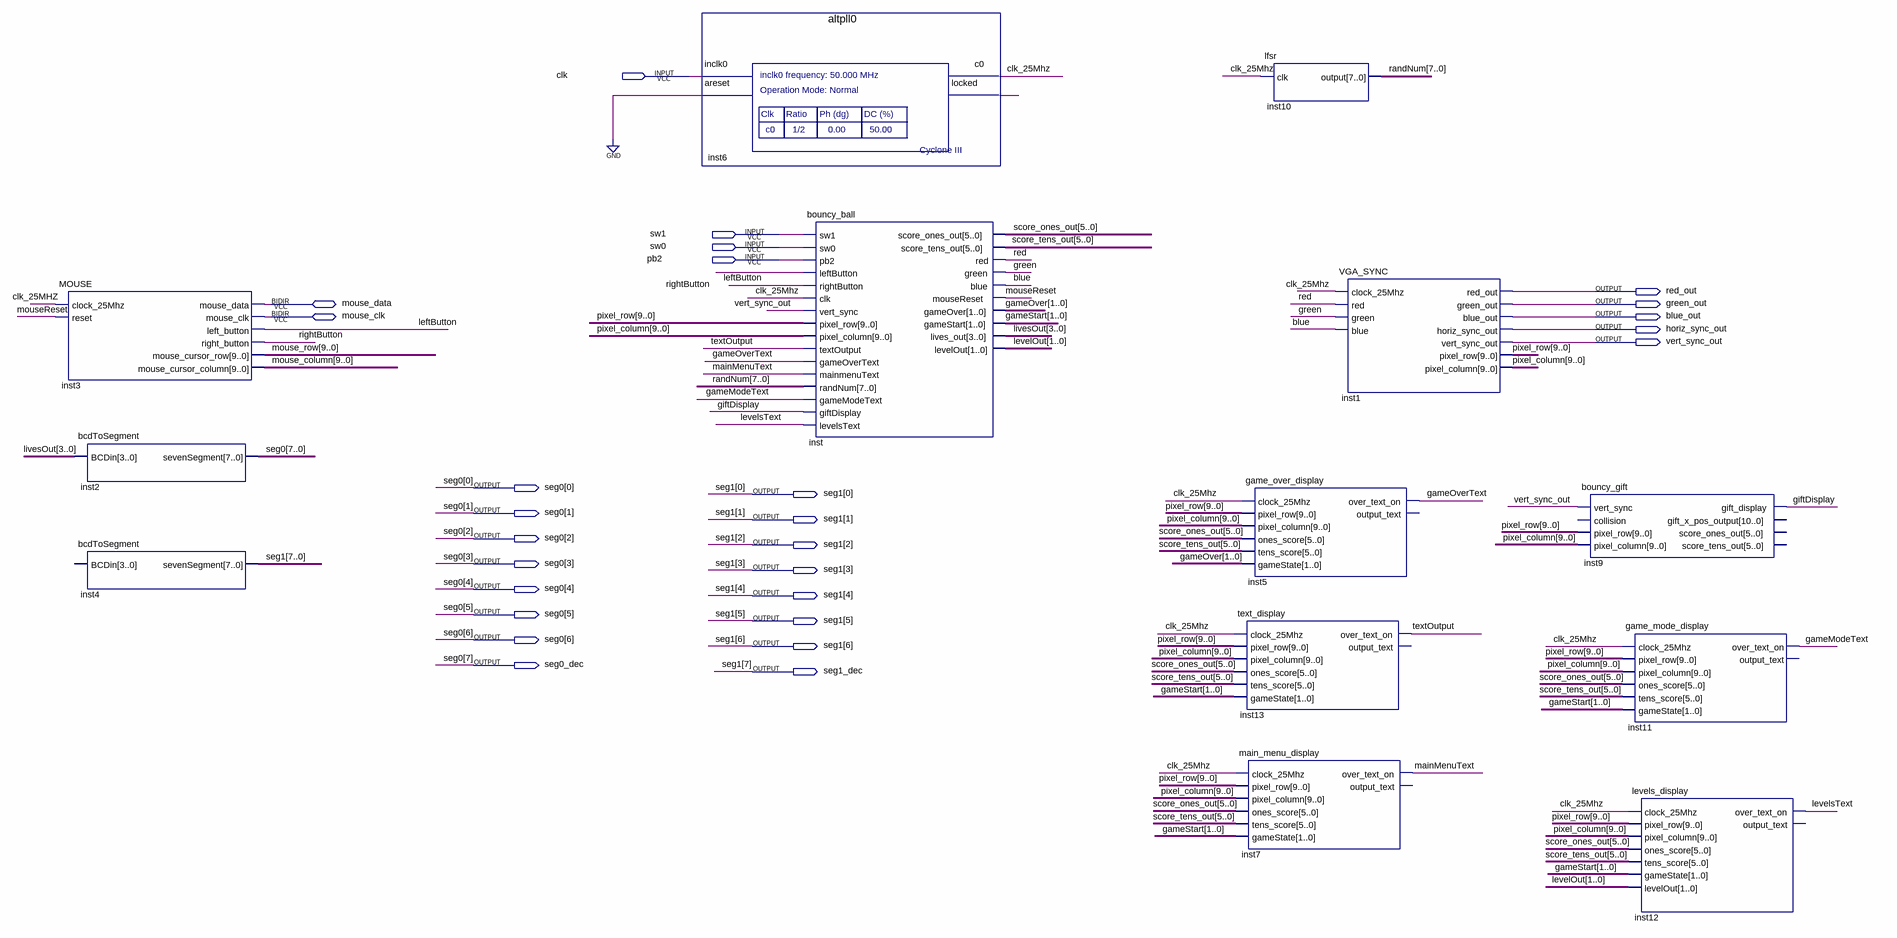
[diagram p0: schematic sheet]
// Quartus schematic mainDiagram.bdf as structural Verilog: 13 symbols, 27 pins
module mainDiagram (
  input  clk,
  input  sw1,
  input  sw0,
  input  pb2,
  inout  mouse_data,
  inout  mouse_clk,
  output red_out,
  output green_out,
  output blue_out,
  output horiz_sync_out,
  output vert_sync_out,
  output [6:0] seg0,
  output [6:0] seg1,
  output seg0_dec,
  output seg1_dec
);

  wire blue, clk_25Mhz, gameModeText, gameOverText, giftDisplay, green, inst6_locked, leftButton, levelsText,
       mainMenuText, mouseReset, red, rightButton, textOutput;
  wire [1:0] gameOver, gameStart, levelOut;
  wire [3:0] livesOut;
  wire [5:0] score_ones_out, score_tens_out;
  wire [7:0] randNum;
  wire [9:0] mouse_column, mouse_row, pixel_column, pixel_row;

  MOUSE inst3 (
    .clock_25Mhz(clk_25Mhz), .reset(mouseReset), .left_button(leftButton), .right_button(rightButton),
    .mouse_cursor_row(mouse_row), .mouse_cursor_column(mouse_column), .mouse_data(mouse_data),
    .mouse_clk(mouse_clk));
  bcdToSegment inst2 (.BCDin(livesOut), .sevenSegment({seg0_dec, seg0}));
  bcdToSegment inst4 (.sevenSegment({seg1_dec, seg1}));  // open: BCDin
  altpll0 inst6 (.inclk0(clk), .areset(1'b0), .c0(clk_25Mhz), .locked(inst6_locked));
  bouncy_ball inst (
    .sw1(sw1), .sw0(sw0), .pb2(pb2), .leftButton(leftButton), .rightButton(rightButton), .clk(clk_25Mhz),
    .vert_sync(vert_sync_out), .pixel_row(pixel_row), .pixel_column(pixel_column), .textOutput(textOutput),
    .gameOverText(gameOverText), .mainmenuText(mainMenuText), .randNum(randNum), .gameModeText(gameModeText),
    .giftDisplay(giftDisplay), .levelsText(levelsText), .score_ones_out(score_ones_out),
    .score_tens_out(score_tens_out), .red(red), .green(green), .blue(blue), .mouseReset(mouseReset),
    .gameOver(gameOver), .gameStart(gameStart), .lives_out(livesOut), .levelOut(levelOut));
  text_display inst13 (
    .clock_25Mhz(clk_25Mhz), .pixel_row(pixel_row), .pixel_column(pixel_column), .ones_score(score_ones_out),
    .tens_score(score_tens_out), .gameState(gameStart), .over_text_on(textOutput));  // open: output_text
  main_menu_display inst7 (
    .clock_25Mhz(clk_25Mhz), .pixel_row(pixel_row), .pixel_column(pixel_column), .ones_score(score_ones_out),
    .tens_score(score_tens_out), .gameState(gameStart), .over_text_on(mainMenuText));  // open: output_text
  lfsr inst10 (.clk(clk_25Mhz), .\output (randNum));
  game_over_display inst5 (
    .clock_25Mhz(clk_25Mhz), .pixel_row(pixel_row), .pixel_column(pixel_column), .ones_score(score_ones_out),
    .tens_score(score_tens_out), .gameState(gameOver), .over_text_on(gameOverText));  // open: output_text
  VGA_SYNC inst1 (
    .clock_25Mhz(clk_25Mhz), .red(red), .green(green), .blue(blue), .red_out(red_out), .green_out(green_out),
    .blue_out(blue_out), .horiz_sync_out(horiz_sync_out), .vert_sync_out(vert_sync_out),
    .pixel_row(pixel_row), .pixel_column(pixel_column));
  bouncy_gift inst9 (
    .vert_sync(vert_sync_out), .pixel_row(pixel_row), .pixel_column(pixel_column), .gift_display(giftDisplay));  // open: collision, gift_x_pos_output, score_ones_out, score_tens_out
  game_mode_display inst11 (
    .clock_25Mhz(clk_25Mhz), .pixel_row(pixel_row), .pixel_column(pixel_column), .ones_score(score_ones_out),
    .tens_score(score_tens_out), .gameState(gameStart), .over_text_on(gameModeText));  // open: output_text
  levels_display inst12 (
    .clock_25Mhz(clk_25Mhz), .pixel_row(pixel_row), .pixel_column(pixel_column), .ones_score(score_ones_out),
    .tens_score(score_tens_out), .gameState(gameStart), .levelOut(levelOut), .over_text_on(levelsText));  // open: output_text

  // Other names for the same wires on the sheet: seg0[7] = seg0_dec; seg1[7] = seg1_dec
endmodule
